# Altium schematic sheet Stepper Teensy Breakout.SchDoc
size A4
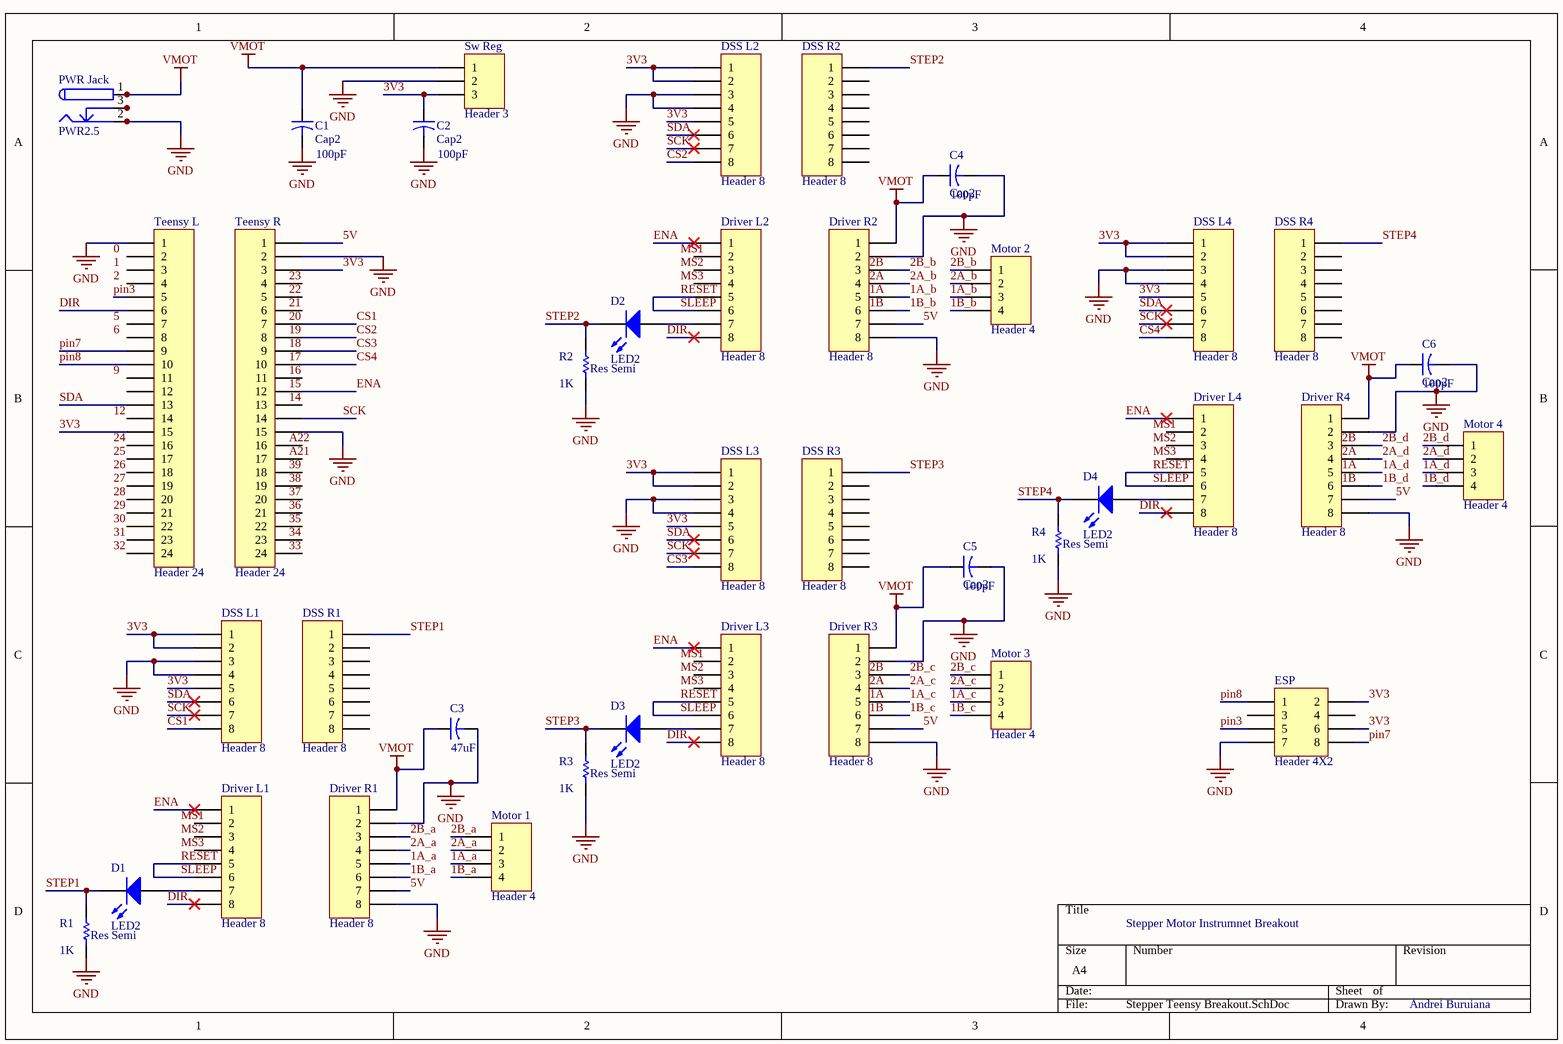
[diagram p0: Stepper Teensy Breakout.SchDoc]

## Parts
C1  Cap2  value 100pF  [CAPR5-4X5]
C2  Cap2  value 100pF  [CAPR5-4X5]
C3  value 47uF  [CAPR5-4X5]
C4  Cap2  value 100pF  [CAPR5-4X5]
C5  Cap2  value 100pF  [CAPR5-4X5]
C6  Cap2  value 100pF  [CAPR5-4X5]
D1  LED2  [3.2X1.6X1.1]
D2  LED2  [3.2X1.6X1.1]
D3  LED2  [3.2X1.6X1.1]
D4  LED2  [3.2X1.6X1.1]
Driver_L1  Header 8  [HDR1X8]
Driver_L2  Header 8  [HDR1X8]
Driver_L3  Header 8  [HDR1X8]
Driver_L4  Header 8  [HDR1X8]
Driver_R1  Header 8  [HDR1X8]
Driver_R2  Header 8  [HDR1X8]
Driver_R3  Header 8  [HDR1X8]
Driver_R4  Header 8  [HDR1X8]
DSS_L1  Header 8  [HDR1X8]
DSS_L2  Header 8  [HDR1X8]
DSS_L3  Header 8  [HDR1X8]
DSS_L4  Header 8  [HDR1X8]
DSS_R1  Header 8  [HDR1X8]
DSS_R2  Header 8  [HDR1X8]
DSS_R3  Header 8  [HDR1X8]
DSS_R4  Header 8  [HDR1X8]
ESP  Header 4X2  [HDR2X4]
Motor_1  Header 4  [HDR1X4]
Motor_2  Header 4  [HDR1X4]
Motor_3  Header 4  [HDR1X4]
Motor_4  Header 4  [HDR1X4]
PWR_Jack  PWR2.5  [KLD-0202]
R1  Res Semi  value 1K  [AXIAL-0.5]
R2  Res Semi  value 1K  [AXIAL-0.5]
R3  Res Semi  value 1K  [AXIAL-0.5]
R4  Res Semi  value 1K  [AXIAL-0.5]
Sw_Reg  Header 3  [HDR1X3]
Teensy_L  Header 24  [HDR1X24]
Teensy_R  Header 24  [HDR1X24]

## Nets
GND: C1.2 C2.2 C3.2 C4.2 C5.2 C6.2 Driver_R1.2 Driver_R1.8 Driver_R2.2 Driver_R2.8 Driver_R3.2 Driver_R3.8 Driver_R4.2 Driver_R4.8 DSS_L1.3 DSS_L1.4 DSS_L2.3 DSS_L2.4 DSS_L3.3 DSS_L3.4 DSS_L4.3 DSS_L4.4 ESP.7 PWR_Jack.2 PWR_Jack.2A PWR_Jack.2B R1.1 R2.1 R3.1 R4.1 Sw_Reg.2 Teensy_L.1 Teensy_R.2 Teensy_R.15
VMOT: C1.1 C3.1 C4.1 C5.1 C6.1 Driver_R1.1 Driver_R2.1 Driver_R3.1 Driver_R4.1 PWR_Jack.1 PWR_Jack.1A PWR_Jack.1B Sw_Reg.1
1A_a: Driver_R1.5 Motor_1.3
1A_b: Driver_R2.5 Motor_2.3
1A_c: Driver_R3.5 Motor_3.3
1A_d: Driver_R4.5 Motor_4.3
1B_a: Driver_R1.6 Motor_1.4
1B_b: Driver_R2.6 Motor_2.4
1B_c: Driver_R3.6 Motor_3.4
1B_d: Driver_R4.6 Motor_4.4
2A_a: Driver_R1.4 Motor_1.2
2A_b: Driver_R2.4 Motor_2.2
2A_c: Driver_R3.4 Motor_3.2
2A_d: Driver_R4.4 Motor_4.2
2B_a: Driver_R1.3 Motor_1.1
2B_b: Driver_R2.3 Motor_2.1
2B_c: Driver_R3.3 Motor_3.1
2B_d: Driver_R4.3 Motor_4.1
3V3: C2.1 DSS_L1.1 DSS_L1.2 DSS_L1.5 DSS_L2.1 DSS_L2.2 DSS_L2.5 DSS_L3.1 DSS_L3.2 DSS_L3.5 DSS_L4.1 DSS_L4.2 DSS_L4.5 ESP.2 ESP.6 Sw_Reg.3 Teensy_L.15 Teensy_R.3
5V: Driver_R1.7 Driver_R2.7 Driver_R3.7 Driver_R4.7 Teensy_R.1
CS1: DSS_L1.8 Teensy_R.7
CS2: DSS_L2.8 Teensy_R.8
CS3: DSS_L3.8 Teensy_R.9
CS4: DSS_L4.8 Teensy_R.10
DIR: Driver_L1.8 Driver_L2.8 Driver_L3.8 Driver_L4.8 Teensy_L.6
ENA: Driver_L1.1 Driver_L2.1 Driver_L3.1 Driver_L4.1 Teensy_R.12
pin3: ESP.5 Teensy_L.5
pin7: ESP.8 Teensy_L.9
pin8: ESP.1 Teensy_L.10
RESET: Driver_L1.5 Driver_L1.6 Driver_L2.5 Driver_L2.6 Driver_L3.5 Driver_L3.6 Driver_L4.5 Driver_L4.6  [also labelled SLEEP]
SCK: DSS_L1.7 DSS_L2.7 DSS_L3.7 DSS_L4.7 Teensy_R.14
SDA: DSS_L1.6 DSS_L2.6 DSS_L3.6 DSS_L4.6 Teensy_L.13
STEP1: D1.2(K) DSS_R1.1 R1.2
STEP2: D2.2(K) DSS_R2.1 R2.2
STEP3: D3.2(K) DSS_R3.1 R3.2
STEP4: D4.2(K) DSS_R4.1 R4.2
NetD1_1: D1.1(A) Driver_L1.7
NetD2_1: D2.1(A) Driver_L2.7
NetD3_1: D3.1(A) Driver_L3.7
NetD4_1: D4.1(A) Driver_L4.7
NetPWR_Jack_3: PWR_Jack.3 PWR_Jack.3A PWR_Jack.3B

Not connected (* = marked no-connect by the designer): Driver_L1 2 3 4; Driver_L2 2 3 4; Driver_L3 2 3 4; Driver_L4 2 3 4; DSS_R1 2 3 4 5 6 7 8; DSS_R2 2 3 4 5 6 7 8; DSS_R3 2 3 4 5 6 7 8; DSS_R4 2 3 4 5 6 7 8; ESP 3 4; Teensy_L 2 3 4 7 8 11 12 14 16 17 18 19 20 21 22 23 24; Teensy_R 4 5 6 11 13 16 17 18 19 20 21 22 23 24

## Notes on the sheet
- Stepper Motor Instrumnet Breakout
- Andrei Buruiana
- Labels drawn without touching a wire or pin: 0, 1, 1A, 1B, 2, 2A, 2B, 5, 6, 9, 12, 14, 15, 16, 17, 18, 19, 20, 21, 22, 23, 24, 25, 26, 27, 28, 29, 30, 31, 32, 33, 34, 35, 36, 37, 38, 39, A21, A22, MS1, MS2, MS3

## Library data of the parts
C1-C6 = Cap2: Capacitor; Published: 23-Sep-2002; PackageReference: CAPR5-4X5; Publisher: Altium Limited; PackageDescription: Capacitor; 2 Leads
D1-D4 = LED2: Typical RED, GREEN, YELLOW, AMBER GaAs LED; Published: 8-Jun-2000; LatestRevisionDate: 17-Jul-2002; LatestRevisionNote: Re-released for DXP Platform.; PackageVersion: Feb-2002; PackageReference: 3.2X1.6X1.1; Publisher: Altium Limited; PackageDescription: SM LED; 2 Flat Leads
Driver_L1-Driver_L4 Driver_R1-Driver_R4 DSS_L1-DSS_L4 DSS_R1-DSS_R4 = Header 8: Header, 8-Pin; LatestRevisionDate: 17-Jul-2002; LatestRevisionNote: Re-released for DXP Platform.; Publisher: Altium Limited
ESP = Header 4X2: Header, 4-Pin, Dual row; LatestRevisionDate: 17-Jul-2002; LatestRevisionNote: Re-released for DXP Platform.; Publisher: Altium Limited
Motor_1-Motor_4 = Header 4: Header, 4-Pin; LatestRevisionDate: 17-Jul-2002; LatestRevisionNote: Re-released for DXP Platform.; Publisher: Altium Limited
PWR_Jack = PWR2.5: Low Voltage Power Supply Connector; Published: 17-Dec-2003; DatasheetDocument: 09-May-2002; Publisher: Altium Limited; ComponentLink1Description: Manufacturer Link; ComponentLink1URL: http://domino.kycon.com/internet/Products.html
R1-R4 = Res Semi: Semiconductor Resistor; Published: 8-Jun-2000; LatestRevisionDate: 17-Jul-2002; LatestRevisionNote: Re-released for DXP Platform.; PackageReference: AXIAL-0.5; Publisher: Altium Limited; PackageDescription: Axial Device, Thru-Hole; 2 Leads; 0.5 in Pin Spacing
Sw_Reg = Header 3: Header, 3-Pin; LatestRevisionDate: 17-Jul-2002; LatestRevisionNote: Re-released for DXP Platform.; Publisher: Altium Limited
Teensy_L Teensy_R = Header 24: Header, 24-Pin; LatestRevisionDate: 17-Jul-2002; LatestRevisionNote: Re-released for DXP Platform.; Publisher: Altium Limited